# EAGLE design REFLOW_TOASTER (EAGLE 8.2.2)
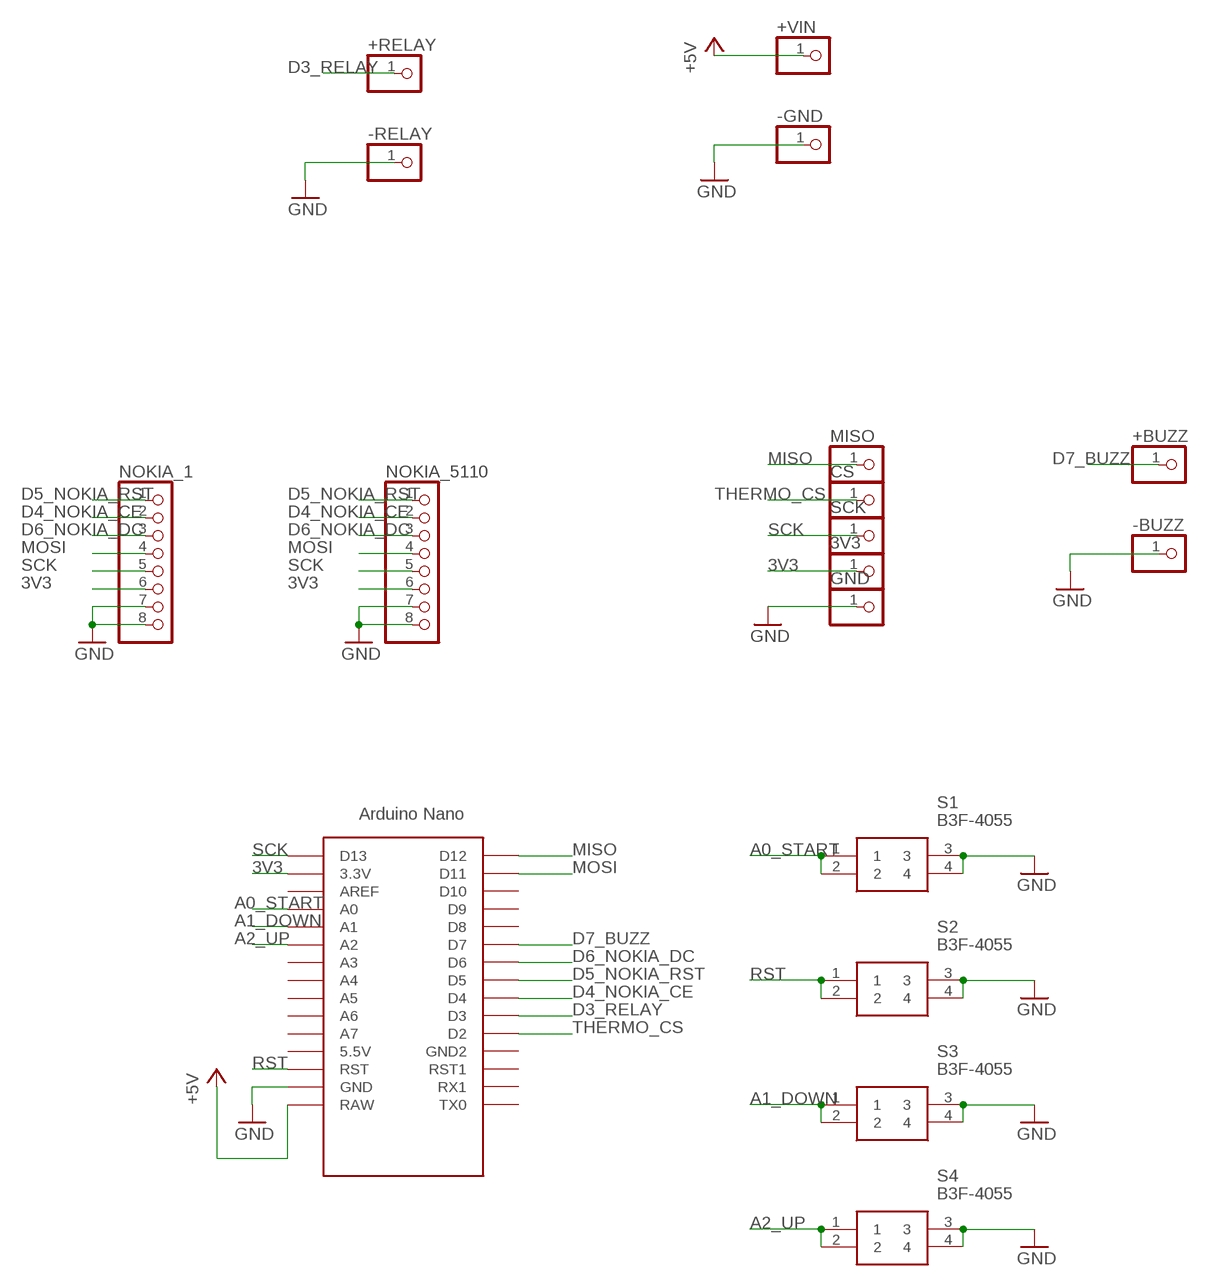
[diagram p0: schematic, sheet 1]

## Parts
3V3  PINHD-1X1CB  [1X01-CLEANBIG]
+BUZZ  PINHD-1X1CB  [1X01-CLEANBIG]
+RELAY  PINHD-1X1CB  [1X01-CLEANBIG]
+VIN  PINHD-1X1CB  [1X01-CLEANBIG]
-BUZZ  PINHD-1X1CB  [1X01-CLEANBIG]
-GND  PINHD-1X1CB  [1X01-CLEANBIG]
-RELAY  PINHD-1X1CB  [1X01-CLEANBIG]
CS  PINHD-1X1CB  [1X01-CLEANBIG]
GND  PINHD-1X1CB  [1X01-CLEANBIG]
MISO  PINHD-1X1CB  [1X01-CLEANBIG]
NOKIA_1  PINHD-1X8CLEANBIG  [1X08-CLEANBIG]
NOKIA_5110  PINHD-1X8CLEANBIG  [1X08-CLEANBIG]
S1  B3F-4055  [B3F-4055]
S2  B3F-4055  [B3F-4055]
S3  B3F-4055  [B3F-4055]
S4  B3F-4055  [B3F-4055]
SCK  PINHD-1X1CB  [1X01-CLEANBIG]
U$1  NANO  [NANO]

## Nets
3V3: 3V3.1 NOKIA_1.6 NOKIA_5110.6 U$1.3.3V
+5V: +VIN.1 U$1.RAW
A0_START: S1.1 S1.2 U$1.A0
A1_DOWN: S3.1 S3.2 U$1.A1
A2_UP: S4.1 S4.2 U$1.A2
D3_RELAY: +RELAY.1 U$1.D3
D4_NOKIA_CE: NOKIA_1.2 NOKIA_5110.2 U$1.D4
D5_NOKIA_RST: NOKIA_1.1 NOKIA_5110.1 U$1.D5
D6_NOKIA_DC: NOKIA_1.3 NOKIA_5110.3 U$1.D6
D7_BUZZ: +BUZZ.1 U$1.D7
GND: -BUZZ.1 -GND.1 -RELAY.1 GND.1 NOKIA_1.7 NOKIA_1.8 NOKIA_5110.7 NOKIA_5110.8 S1.3 S1.4 S2.3 S2.4 S3.3 S3.4 S4.3 S4.4 U$1.GND
MISO: MISO.1 U$1.D12
MOSI: NOKIA_1.4 NOKIA_5110.4 U$1.D11
RST: S2.1 S2.2 U$1.RST
SCK: NOKIA_1.5 NOKIA_5110.5 SCK.1 U$1.D13
THERMO_CS: CS.1 U$1.D2
Unconnected: U$1.5V(5.5V) U$1.A3 U$1.A4 U$1.A5 U$1.A6 U$1.A7 U$1.AREF U$1.D8 U$1.D9 U$1.D10 U$1.GND1(GND2) U$1.ICSP1 U$1.ICSP2 U$1.ICSP3 U$1.ICSP4 U$1.ICSP5 U$1.ICSP6 U$1.RST1 U$1.RX1 U$1.TX0

## Library data of the parts
3V3 +BUZZ +RELAY +VIN -BUZZ -GND -RELAY CS GND MISO SCK = adafruit:PINHD-1X1: Pin header 1x1 for 0.1" spacing With round pins
NOKIA_1 NOKIA_5110 = adafruit:PINHD-1X8: PIN HEADER
S1-S4 = B3F-4055:B3F-4055: Yellow Plunger Tactile Switch, SPST-NO 0.05 A@ 24 V dc 3mm Source: Datasheet <https://www.omron.com/ecb/products/pdf/en-b3f.pdf>; ARROW_PART_NUMBER: B3F-4055; ARROW_PRICE/STOCK: https://www.arrow.com/en/products/b3f4055/omron; DESCRIPTION: Yellow Plunger Tactile Switch, SPST-NO 0.05 A@ 24 V dc 3mm; HEIGHT: mm; MANUFACTURER_NAME: Omron Electronics; MANUFACTURER_PART_NUMBER: B3F-4055; RS_PART_NUMBER: 6866777P; RS_PRICE/STOCK: http://uk.rs-online.com/web/p/products/6866777P
U$1 = Arduino-clone:NANO: Arduino Nano

## Board
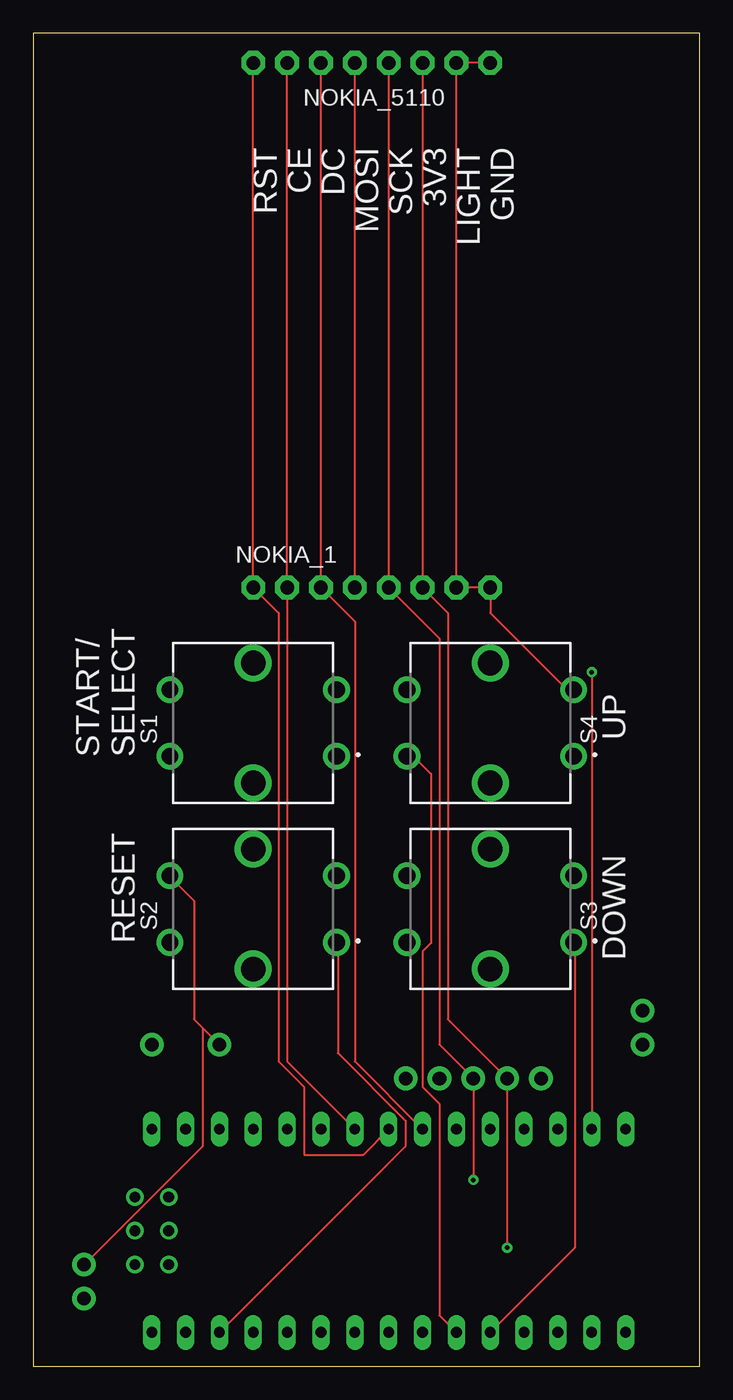
[diagram p1: board, top side]
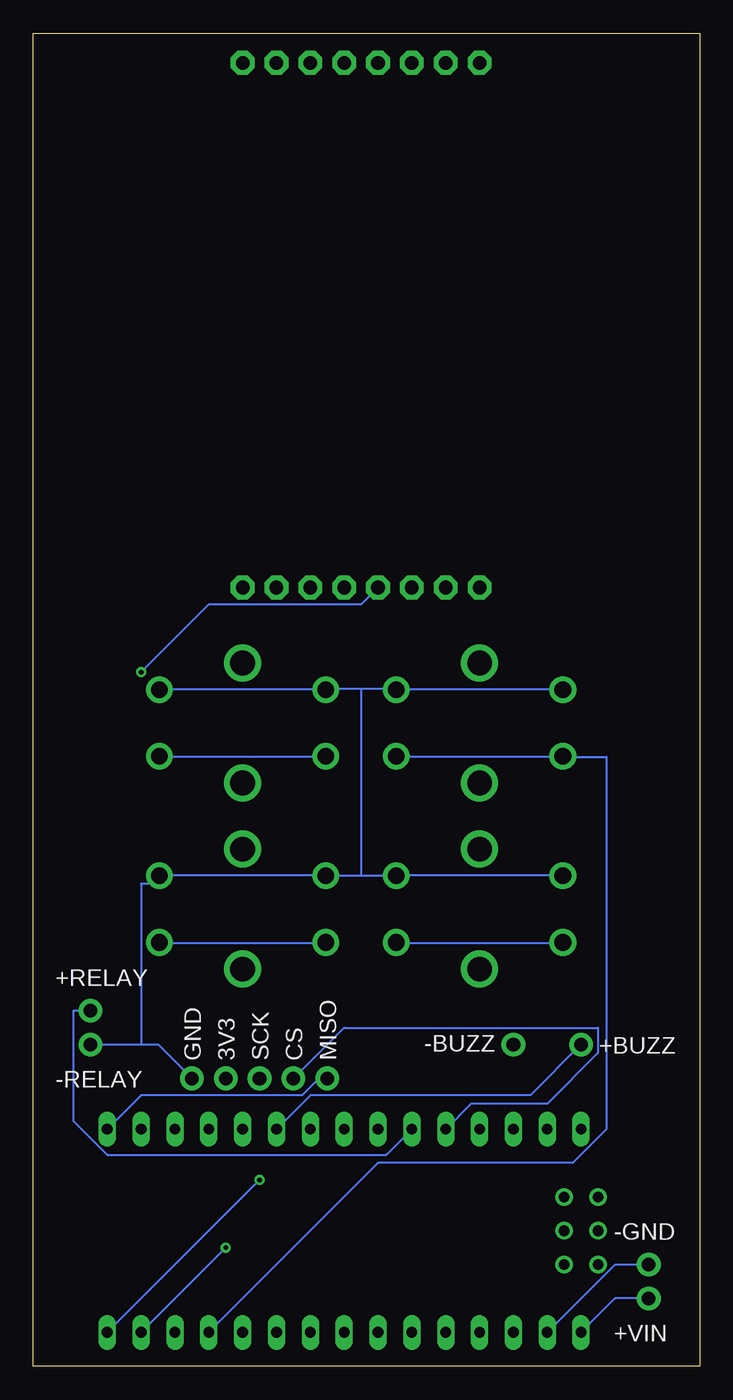
[diagram p2: board, bottom side, seen from below]

Size 50 x 100 mm. Coordinates in mm from the lower left corner, seen from the top.
Outline: 0,0 50,0 50,100 0,100 0,0
Copper layers (1*16): Top 0.035mm / dielectric 1.5mm / Bottom 0.035mm
Design rules "default": minimum track width 6mil, minimum drill 0.35mm, track to track 6mil, track to pad 6mil, pad to pad 6mil, via to via 6mil, smd to smd 6mil, copper to edge 40mil, drill to drill 6mil, minimum pad ring 10mil, minimum via ring 8mil, stop-mask expansion 4mil, vias tented up to drill 0mil, thermal gap 10mil

### Footprints (pad centres in the part's own frame; a part is rotated, then mirrored left to right if it is on the bottom)
1X01-CLEANBIG = drill 1.016 pad 1.778: 1 0,0
1X08-CLEANBIG = drill 1.016 pad 1.778 octagon: 1 -8.89,0; 2 -6.35,0; 3 -3.81,0; 4 -1.27,0; 5 1.27,0; 6 3.81,0; 7 6.35,0; 8 8.89,0
B3F-4055 = drill 1.25 pad 2: 1 6.25,-2.5; 2 -6.25,-2.5; 3 6.25,2.5; 4 -6.25,2.5 | drill 1.85 pad 1.85: 5 0,4.5; 6 0,-4.5
NANO = drill 0.8 long: 3.3V -10.16,24.13; 5V -10.16,-1.27; A0 -10.16,19.05; A1 -10.16,16.51; A2 -10.16,13.97; A3 -10.16,11.43; A4 -10.16,8.89; A5 -10.16,6.35; A6 -10.16,3.81; A7 -10.16,1.27; AREF -10.16,21.59; D2 5.08,1.27; D3 5.08,3.81; D4 5.08,6.35; D5 5.08,8.89; D6 5.08,11.43; D7 5.08,13.97; D8 5.08,16.51; D9 5.08,19.05; D10 5.08,21.59; D11 5.08,24.13; D12 5.08,26.67; D13 -10.16,26.67; GND -10.16,-6.35; GND1 5.08,-1.27; RAW -10.16,-8.89; RST -10.16,-3.81; RST1 5.08,-3.81; RX1 5.08,-6.35; TX0 5.08,-8.89 | drill 0.8: ICSP1 -5.08,-10.16; ICSP2 -5.08,-7.62; ICSP3 -2.54,-10.16; ICSP4 -2.54,-7.62; ICSP5 0,-10.16; ICSP6 0,-7.62

### Placement (x,y rotation side)
3V3  35.56,21.59 180 top
+BUZZ  8.89,24.13 0 top
+RELAY  45.72,26.67 0 bottom
+VIN  3.81,5.08 0 bottom
-BUZZ  13.97,24.13 0 top
-GND  3.81,7.62 0 bottom
-RELAY  45.72,24.13 0 bottom
CS  30.48,21.59 180 top
GND  38.1,21.59 180 top
MISO  27.94,21.59 180 top
NOKIA_1  25.4,58.42 0 top
NOKIA_5110  25.4,97.79 0 top
S1  16.51,48.26 0 top
S2  16.51,34.29 0 top
S3  34.29,34.29 0 top
S4  34.29,48.26 0 top
SCK  33.02,21.59 180 top
U$1  17.78,12.7 90 bottom

### Tracks (layer width: path | path; a pad name or v marks a point on that pad's centre or on a via)
3V3  (via drill 0.35)
  Top 0.152: v35.56,8.89 3V3.1 31.11,26.04 31.11,56.52 NOKIA_1.6 NOKIA_5110.6
  Bottom 0.152: v35.56,8.89 U$1.3.3V
+5V
  Bottom 0.152: U$1.RAW 6.35,5.08 +VIN.1
A0_START
  Bottom 0.152: U$1.A0 24.13,15.24 9.53,15.24 6.99,17.78 6.99,45.72 10.16,45.72 S1.2 10.79,45.72 22.23,45.72 S1.1
A1_DOWN
  Top 0.152: U$1.A1 40.64,8.89 40.64,31.75 S3.1
  Bottom 0.152: S3.2 28.57,31.75 40.01,31.75 S3.1
A2_UP
  Top 0.152: U$1.A2 30.48,3.81 30.48,19.68 29.21,20.95 29.21,31.11 29.84,31.75 29.84,44.45 28.57,45.72 S4.2
  Bottom 0.152: S4.1 40.01,45.72 28.57,45.72 S4.2
D3_RELAY
  Bottom 0.152: U$1.D3 23.5,15.88 44.45,15.88 46.99,18.41 46.99,26.67 +RELAY.1
D4_NOKIA_CE
  Top 0.152: U$1.D4 19.05,22.86 NOKIA_1.2 NOKIA_5110.2
D5_NOKIA_RST
  Top 0.152: U$1.D5 24.77,15.88 20.32,15.88 20.32,20.95 18.41,22.86 18.41,56.52 NOKIA_1.1 NOKIA_5110.1
D6_NOKIA_DC
  Top 0.152: U$1.D6 24.13,22.86 24.13,55.88 NOKIA_1.3 NOKIA_5110.3
D7_BUZZ
  Bottom 0.152: U$1.D7 29.21,20.32 12.7,20.32 +BUZZ.1
GND
  Top 0.152: 12.7,25.4 12.06,26.04 12.06,34.92 10.79,36.2 S2.4 | 12.7,25.4 -BUZZ.1 | -GND.1 12.7,16.51 12.7,25.4 | NOKIA_5110.8 NOKIA_5110.7 NOKIA_1.7 NOKIA_1.8 34.29,56.52 40.01,50.8 S4.3
  Bottom 0.152: GND.1 40.64,24.13 41.91,24.13 | -RELAY.1 41.91,24.13 | 25.4,36.83 27.94,36.83 S3.4 28.57,36.83 40.01,36.83 S3.3 40.64,36.2 41.91,36.2 41.91,24.13 | 25.4,36.83 22.86,36.83 S2.3 22.23,36.83 10.79,36.83 S2.4 | U$1.GND 6.35,7.62 -GND.1 | S1.4 10.79,50.8 22.23,50.8 S1.3 22.86,50.8 25.4,50.8 | 25.4,50.8 27.94,50.8 S4.4 28.57,50.8 40.01,50.8 S4.3 | 25.4,50.8 25.4,36.83
MISO
  Bottom 0.152: U$1.D12 41.91,20.32 29.84,20.32 28.57,21.59 MISO.1
MOSI  (via drill 0.35)
  Top 0.152: v41.91,52.07 U$1.D11 | NOKIA_1.4 NOKIA_5110.4
  Bottom 0.152: v41.91,52.07 36.83,57.15 25.4,57.15 NOKIA_1.4
RST
  Top 0.152: U$1.RST 27.94,16.51 27.94,18.41 22.86,23.5 22.86,31.75 S2.1
  Bottom 0.152: S2.2 10.79,31.75 22.23,31.75 S2.1
SCK  (via drill 0.35)
  Top 0.152: v33.02,13.97 SCK.1 30.48,24.13 30.48,54.61 NOKIA_1.5 NOKIA_5110.5
  Bottom 0.152: v33.02,13.97 U$1.D13
THERMO_CS
  Bottom 0.152: U$1.D2 17.14,19.68 11.43,19.68 7.62,23.5 7.62,25.4 26.67,25.4 CS.1

### Text on the board
tPlace: RST | CE | DC | MOSI | SCK | 3V3 | LIGHT | GND | UP | START/ / SELECT | RESET | DOWN